# Altium project TeensyCrashDAQ.PrjPcb
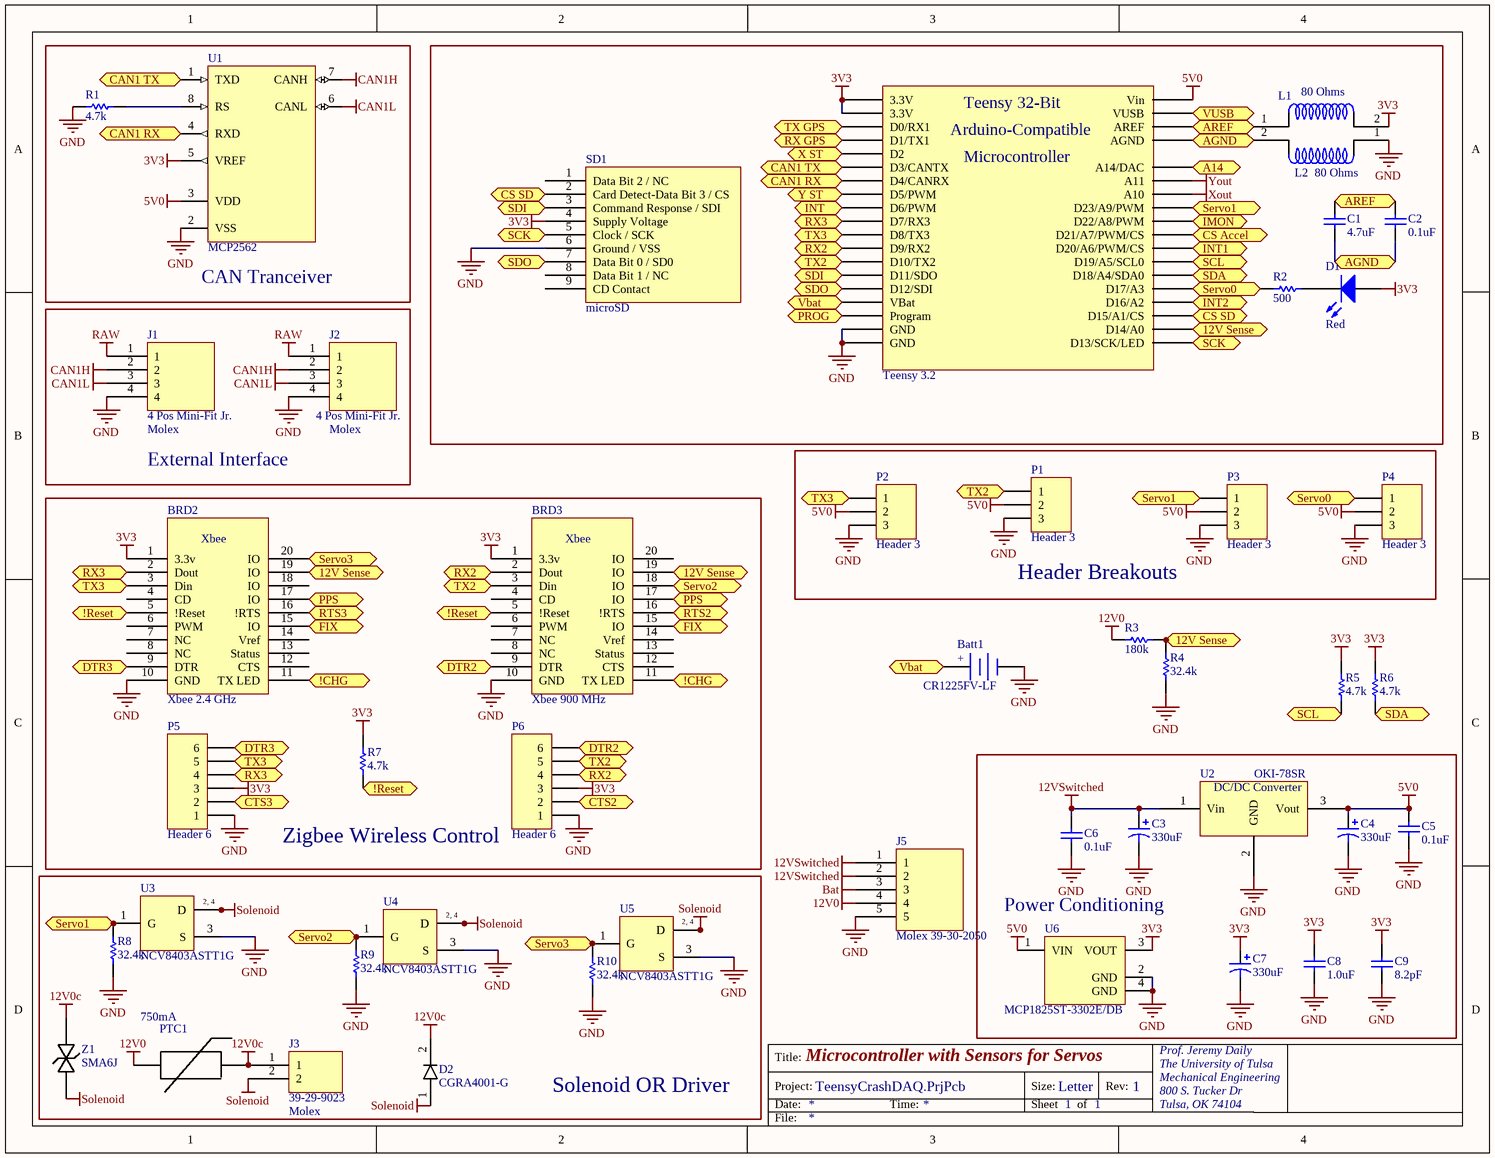
[diagram p0: TeensyCrashDAQ.SchDoc]
2 sheets, 103 parts. Net scope: flat (ports and power ports of the same name join across sheets).
Board file: CrashDAQ For Hammond 1554H.PcbDoc
Sheets:
  TeensyCrashDAQ.SchDoc
  CrashDAQSensors.SchDoc

## Sheet TeensyCrashDAQ.SchDoc: Microcontroller with Sensors for Servos
size Letter; Author: Prof. Jeremy Daily; Organization: The University of Tulsa; Address1: Mechanical Engineering; Address2: 800 S. Tucker Dr; Address3: Tulsa, OK 74104; DocumentNumber: 1; Revision: 1; SheetNumber: 1; SheetTotal: 1

### Parts
Batt1  CR1225FV-LF  [Coin Cell with Tabs]
BRD1  Teensy 3.2  [Teensy]
BRD2  Xbee 2.4 GHz  [Xbee]
BRD3  Xbee 900 MHz  [Xbee]
C1  4.7uF  [1206]
C2  0.1uF  [0603]
C3  330uF  [Elec. Cap 5 x 10mm]
C4  330uF  [Elec. Cap 5 x 10mm]
C5  0.1uF  [0603]
C6  0.1uF  [0603]
C7  330uF  [Elec. Cap 5 x 10mm]
C8  1.0uF  [0603]
C9  8.2pF  [0603]
D1  Red  [0805 Polarized]
D2  CGRA4001-G  [SMA with A and K]
J1  4 Pos Mini-Fit Jr.  Manufacturer: Molex  [4 POS Vertical MINI-FIT JR]
J2  4 Pos Mini-Fit Jr.  Manufacturer: Molex  [4 POS Vertical MINI-FIT JR]
J3  39-29-9023  Manufacturer: Molex  [2 POS Vertical MINI-FIT JR]
J5  Molex 39-30-2050  [5 POS Vert MINI-FIT JR]
L1  80 Ohms  [0805]
L2  80 Ohms  [0805]
P1  Header 3  [HDR1X3]
P2  Header 3  [HDR1X3]
P3  Header 3  [HDR1X3]
P4  Header 3  [HDR1X3]
P5  Header 6  [HDR1X6]
P6  Header 6  [HDR1X6]
PTC1  750mA  [2920]
R1  4.7k  [0603]
R2  500  [0603]
R3  180k  [0603]
R4  32.4k  [0603]
R5  4.7k  [0603]
R6  4.7k  [0603]
R7  4.7k  [0603]
R8  32.4k  [0603]
R9  32.4k  [0603]
R10  32.4k  [0603]
SD1  microSD  [SD Card Holder]
U1  MCP2562  [SOIC-8]
U2  OKI-78SR  [78xx]
U3  NCV8403ASTT1G  [ONSC-SOT-223-4-318E-04_V]
U4  NCV8403ASTT1G  [ONSC-SOT-223-4-318E-04_V]
U5  NCV8403ASTT1G  [ONSC-SOT-223-4-318E-04_V]
U6  MCP1825ST-3302E/DB  [SOT-223-DB3_M]
Z1  SMA6J  [SMA]

### Blocks framed on the sheet
CAN Tranceiver: R1 U1
External Interface: J1 J2
Header Breakouts: P1-P4
Zigbee Wireless Control: BRD2 BRD3 P5 P6 R7
Power Conditioning: C3-C9 U2 U6
Solenoid OR Driver: D2 J3 PTC1 R8-R10 U3-U5 Z1

### Ports
12V Sense, !CHG, !Reset, A14, AGND, AREF, CAN1 RX, CAN1 TX, CS Accel, CS SD, CTS2, CTS3, DTR2, DTR3, FIX, IMON, INT, INT1, INT2, PPS, PROG, RTS2, RTS3, RX2, RX3, RX GPS, SCK, SCL, SDA, SDI, SDO, Servo0, Servo1, Servo2, Servo3, TX2, TX3, TX GPS, Vbat, VUSB, X ST, Y ST

### Nets
3V3: BRD1.16(3.3V) BRD1.31(3.3V) BRD2.1(3.3v) BRD3.1(3.3v) C7.1 C8.2 C9.2 D1.1(A) L1.2 P5.3 P6.3 R5.2 R6.2 R7.2 SD1.4(Supply_Voltage) U1.5(VREF) U6.3(VOUT)
5V0: BRD1.33(Vin) C4.1 C5.2 P1.2 P2.2 P3.2 P4.2 U1.3(VDD) U2.3(Vout) U6.1(VIN)
12V0: J5.4 PTC1.1 R3.1
12V0c: D2.2(K) J3.1 PTC1.2 Z1.1(A)
12VSwitched: C3.1 C6.2 J5.1 J5.2 U2.1(Vin)
Bat: J5.3
CAN1H: J1.2 J2.2 U1.7(CANH)
CAN1L: J1.3 J2.3 U1.6(CANL)
GND: Batt1.2(-) BRD1.14(GND) BRD1.17(GND) BRD2.10(GND) BRD3.10(GND) C3.2 C4.2 C5.1 C6.1 C7.2 C8.1 C9.1 J1.4 J2.4 J5.5 L2.1 P1.3 P2.3 P3.3 P4.3 P5.1 P6.1 R1.1 R4.1 R8.1 R9.1 R10.1 SD1.6(Ground_/_VSS) U1.2(VSS) U2.2(GND) U3.3(S) U4.3(S) U5.3(S) U6.2(GND) U6.4(GND)
RAW: J1.1 J2.1
Solenoid: D2.1(A) J3.2 U3.2(D) U3.4(D) U4.2(D) U4.4(D) U5.2(D) U5.4(D) Z1.2(K)
Xout: BRD1.36(A10)
Yout: BRD1.37(A11)
NetBatt1_1: Batt1.1(+) BRD1.15(VBat) ; port Vbat
NetBRD1_1: BRD1.1(D12/SDI) SD1.7(Data_Bit_0_/_SD0) ; port SDO
NetBRD1_2: BRD1.2(D11/SDO) SD1.3(Command_Response_/_SDI) ; port SDI
NetBRD1_3: BRD1.3(D10/TX2) BRD3.3(Din) P1.1 P6.5 ; port TX2
NetBRD1_4: BRD1.4(D9/RX2) BRD3.2(Dout) P6.4 ; port RX2
NetBRD1_5: BRD1.5(D8/TX3) BRD2.3(Din) P2.1 P5.5 ; port TX3
NetBRD1_6: BRD1.6(D7/RX3) BRD2.2(Dout) P5.4 ; port RX3
NetBRD1_7: BRD1.7(D6/PWM) ; port INT
NetBRD1_8: BRD1.8(D5/PWM) ; port Y ST
NetBRD1_9: BRD1.9(D4/CANRX) U1.4(RXD) ; port CAN1 RX
NetBRD1_10: BRD1.10(D3/CANTX) U1.1(TXD) ; port CAN1 TX
NetBRD1_11: BRD1.11(D2) ; port X ST
NetBRD1_12: BRD1.12(D1/TX1) ; port RX GPS
NetBRD1_13: BRD1.13(D0/RX1) ; port TX GPS
NetBRD1_18: BRD1.18(Program) ; port PROG
NetBRD1_19: BRD1.19(A14/DAC) ; port A14
NetBRD1_20: BRD1.20(D13/SCK/LED) SD1.5(Clock_/_SCK) ; port SCK
NetBRD1_21: BRD1.21(D14/A0) BRD2.19(IO) BRD3.19(IO) R3.2 R4.2 ; port 12V Sense
NetBRD1_22: BRD1.22(D15/A1/CS) SD1.2(Card_Detect-Data_Bit_3_/_CS) ; port CS SD
NetBRD1_23: BRD1.23(D16/A2) ; port INT2
NetBRD1_24: BRD1.24(D17/A3) P4.1 R2.2 ; port Servo0
NetBRD1_25: BRD1.25(D18/A4/SDA0) R6.1 ; port SDA
NetBRD1_26: BRD1.26(D19/A5/SCL0) R5.1 ; port SCL
NetBRD1_27: BRD1.27(D20/A6/PWM/CS) ; port INT1
NetBRD1_28: BRD1.28(D21/A7/PWM/CS) ; port CS Accel
NetBRD1_29: BRD1.29(D22/A8/PWM) ; port IMON
NetBRD1_30: BRD1.30(D23/A9/PWM) P3.1 R8.2 U3.1(G) ; port Servo1
NetBRD1_32: BRD1.32(AGND) C1.1 C2.1 L2.2 ; port AGND
NetBRD1_34: BRD1.34(VUSB) ; port VUSB
NetBRD1_35: BRD1.35(AREF) C1.2 C2.2 L1.1 ; port AREF
NetBRD2_5: BRD2.5(!Reset) BRD3.5(!Reset) R7.1 ; port !Reset
NetBRD2_9: BRD2.9(DTR) P5.6 ; port DTR3
NetBRD2_11: BRD2.11(TX_LED) BRD3.11(TX_LED) ; port !CHG
NetBRD2_15: BRD2.15(IO) BRD3.15(IO) ; port FIX
NetBRD2_16: BRD2.16(!RTS) ; port RTS3
NetBRD2_17: BRD2.17(IO) BRD3.17(IO) ; port PPS
NetBRD2_20: BRD2.20(IO) R10.2 U5.1(G) ; port Servo3
NetBRD3_9: BRD3.9(DTR) P6.6 ; port DTR2
NetBRD3_16: BRD3.16(!RTS) ; port RTS2
NetBRD3_18: BRD3.18(IO) R9.2 U4.1(G) ; port Servo2
NetD1_2: D1.2(K) R2.1
NetP5_2: P5.2 ; port CTS3
NetP6_2: P6.2 ; port CTS2
NetR1_2: R1.2 U1.8(RS)

Not connected (* = marked no-connect by the designer): BRD2 4(CD) 6(PWM) 7(NC) 8(NC) 12(CTS) 13(Status) 14(Vref) 18(IO); BRD3 4(CD) 6(PWM) 7(NC) 8(NC) 12(CTS) 13(Status) 14(Vref) 20(IO); SD1 1(Data_Bit_2_/_NC) 8(Data_Bit_1_/_NC) 9(CD_Contact)

### Notes on the sheet
- Title:
- Project:
- Date:
- Time:
- Sheet
- Size:
- Letter
- of
- Rev:
- File:
- (in symbol 7805) DC/DC Converter
- (in symbol NCV8403ASTT1G) 2, 4
- (in symbol Teensy) Teensy 32-Bit; Arduino-Compatible; Microcontroller

### Library data of the parts
Batt1 = CR2032 Battery Holder: Coin Cell Battery 3V 2-PIN VERT 48mAh 12.5 x 2.5mm; Manufacturer: Renata; Supplier 1: Mouser; Supplier Part Number 1: 614-CR1225FV-LF; PartNumber: CR1225FV-LF
BRD1 = Teensy: 32 Bit Arduino-Compatible Microcontroller; Manufacturer: PRJC; PartNumber: Teensy 3.2; Supplier 1: Sparkfun; Supplier Part Number 1: DEV-13736
BRD2 BRD3 = Xbee
C1 = Cap: 4.7µF ±10% 50V X7R Ceramic Capacitor -55°C ~ 125°C Surface Mount, MLCC 1206; Manufacturer: Samsung Electro-Mechanics America, Inc.; PartNumber: CL31B475KBHNNNE; Supplier 1: Digi-Key; Supplier Part Number 1: 1276-2789-1-ND
C2 C5 C6 = Cap: 0.10µF ±10% 50V X7R Ceramic Capacitor -55°C ~ 125°C Surface Mount, MLCC 0603 (1608 Metric) 0.063" L x 0.031" W (1.60mm x 0.80mm); Manufacturer: Murata Electronics North America; PartNumber: GRM188R71H104KA93D; Supplier 1: Digi-Key; Supplier Part Number 1: 490-1519-1-ND
C3 C4 C7 = SMD Elec: CAP ALUM 330UF 20% 50V RADIAL; Manufacturer: Panasonic Electronic Components; PartNumber: ECA-1HM331; Supplier 1: Digi-Key; Supplier Part Number 1: P5184-ND
C8 = Cap: 1µF ±10% 10V X5R Ceramic Capacitor -55°C ~ 85°C Surface Mount, MLCC 0603 (1608 Metric) 0.063" L x 0.031" W (1.60mm x 0.80mm); Manufacturer: Murata Electronics North America; PartNumber: GRM188R61A105KA61D; Supplier 1: Digi-Key; Supplier Part Number 1: 490-1543-1-ND
C9 = Cap: 8.2pF ±0.5pF 50V C0G, NP0 Ceramic Capacitor -55°C ~ 125°C Surface Mount, MLCC 0201 (0603 Metric) 0.024" L x 0.012" W (0.60mm x 0.30mm); Manufacturer: Murata Electronics North America; PartNumber: GRM0335C1H8R2DA01D; Supplier 1: Digi-Key; Supplier Part Number 1: 490-6133-2-ND
D1 = LED - SMD: LED RED DIFFUSED 0805 SMD; Manufacturer: OSRAM Opto Semiconductors Inc.; PartNumber: LS R976-NR-1; Supplier 1: Digi-Key; Supplier Part Number 1: 475-1278-1-ND
D2 = Diode: DIODE GEN PURP 50V 1A DO214AC; Supplier 1: Digi-Key
J1 J2 = 4 Pos Header Vert: CONN HEADER 4POS 4.2MM VERT TIN; Supplier 1: Mouser; Supplier 2: Mouser; PartNumber: 39-29-9040; Supplier Part Number 1: 538-39-29-9040; Supplier Part Number 2: 538-39-29-9040
J3 = 2 Pos Header Vert: 2 Positions Header, Shrouded Connector Through Hole Tin; PartNumber: 39-29-9023; Supplier 1: Digi-Key; Supplier 2: Mouser; Supplier Part Number 1: WM3853-ND; Supplier Part Number 2: 538-39-29-9023
J5 = 5 Pos Header Vert: Molex Mint Fit Jr 5 CKT VERT HEADER
L1 L2 = Ferrite Bead: Ferrite Bead 80ohms 100MHz 5A Monolithic 0805 SMD; Manufacturer: Laird Technologies; PartNumber: HI0805R800R-10; Supplier 1: Mouser; Supplier Part Number 1: 875-HI0805R800R-10
P1-P4 = Header 3: Header, 3-Pin; LatestRevisionDate: 17-Jul-2002; LatestRevisionNote: Re-released for DXP Platform.; Publisher: Altium Limited
P5 P6 = Header 6: Header, 6-Pin; LatestRevisionDate: 17-Jul-2002; LatestRevisionNote: Re-released for DXP Platform.; Publisher: Altium Limited
PTC1 = PTC: PTC RESETBL 60V 750MA SMD 2920; Manufacturer: Littelfuse; PartNumber: 2920L075/60MR; Supplier 1: Digi-Key; Supplier Part Number 1: F5633CT-ND
R1 R5-R7 = Chip Resistor: 4.7k Ohm ±1% 0.1W, 1/10W Surface Mount Resistor Thick Film ±100ppm/°C 0603; Manufacturer: Panasonic Electronic Components; PartNumber: ERJ-3EKF4701V; Supplier 1: Digi-Key; Supplier Part Number 1: P4.70KHCT-ND
R2 R3 = Chip Resistor: Manufacturer: Panasonic Electronic Components; PartNumber: ERJ-3EKF1001V; Supplier 1: Digi-Key; Supplier Part Number 1: P1.00KHCT-ND
R4 R8-R10 = Chip Resistor: 32.4k Ohm ±1% 0.1W, 1/10W Surface Mount Resistor Thick Film ±100ppm/°C 0603; Manufacturer: Panasonic Electronic Components; PartNumber: ERJ-3EKF3242V; Supplier 1: Digi-Key; Supplier Part Number 1: P32.4KHCT-ND
SD1 = SD Card Holder: CONN MICRO SD CARD PUSH-PUSH R/A; Manufacturer: Amphenol Commercial Products; PartNumber: 101-00660-68-6; Supplier 1: Digi-Key; Supplier Part Number 1: 101-00660-68-6-1-ND
U1 = MCP2551-I/P: High-Speed CAN Transceiver, 8-Pin PDIP, Industrial Temperature; Manufacturer: Microchip; PartNumber: MCP2562FD-E/P; DatasheetVersion: revF, Jul-2010; PackageVersion: revBB, Aug-2009; PackageReference: PDIP300-P8; PackageDescription: 8-Lead Plastic Dual In-Line (P) - 300 mil Body [PDIP]; Supplier 1: Mouser; Supplier Part Number 1: 579-MCP2562FD-E/P; Supplier 2: Farnell; Supplier Part Number 2: 1292240; Supplier 3: Newark; Supplier Part Number 3: 61K2947; Supplier 4: Mouser; Supplier Part Number 4: 579-MCP2551-I/P; Mounting Technology: Through Hole; Code_JEDEC: MS-001; ComponentLink1Description: Manufacturer URL; ComponentLink1URL: http://www.microchip.com/; ComponentLink2Description: Datasheet; ComponentLink2URL: http://ww1.microchip.com/downloads/en/DeviceDoc/21667F.pdf; ComponentLink3Description: Package Specification; ComponentLink3URL: http://www.microchip.com/stellent/groups/techpub_sg/documents/packagingspec/en012702.pdf
U2 = 7805: 5V DC/DC Converter (7805 replacement); Manufacturer: Murata Power Solutions; PartNumber: OKI-78SR-5/1.5-W36H-C; Supplier 1: Mouser; Supplier 2: Digi-Key; Supplier Part Number 1: 580-OKI78SR51.5W36HC; Supplier Part Number 2: 811-2692-ND
U3-U5 = NCV8403ASTT1G: Self-Protected Low Side Driver with Temperature and Current Limit, 4-Pin SOT-223, Pb-Free, Tape and Reel; Manufacturer: On Semiconductor; Channel Polarity: N Channel; DatasheetVersion: Rev. 5; PackageVersion: Rev. N, 08/2009; PackageReference: SOT-223-4-318E-04; PackageDescription: 4-Pin Small Outline Transistor, Body 6.5 x 3.5 mm, Pitch 2.3 mm; Supplier 1: Digi-Key; Supplier Part Number 1: NCV8403ASTT1G-ND; Supplier 2: Mouser; Supplier Part Number 2: 863-NCV8403ASTT1G; Packing: Tape and Reel; RoHS: Pb-Free; Mounting Technology: Surface Mount; PartNumber: NCV8403ASTT1G; ComponentLink1Description: Manufacturer URL; ComponentLink1URL: http://www.onsemi.com/; ComponentLink2Description: Datasheet; ComponentLink2URL: http://www.onsemi.com/pub_link/Collateral/NCV8403-D.PDF; ComponentLink3Description: Package Specification; ComponentLink3URL: http://www.onsemi.com/pub_link/Collateral/318E-04.PDF
U6 = MCP1825ST-3302E/DB: 500 mA, Low Voltage, Low Quiescent Current LDO Regulator, 3-Pin SOT-223, Extended Temperature, Tape and Reel; Manufacturer: Microchip; DatasheetVersion: revB, Feb-2008; PackageVersion: revBB, Aug-2009; PackageReference: SOT-223-DB3; PackageDescription: 3-Lead Plastic Small Outline Transistor (DB) [SOT-223]; Supplier 1: Digi-Key; Supplier Part Number 1: MCP1825ST-3302E/DBTR-ND; Supplier 2: Mouser; Supplier Part Number 2: 579-MCP1825ST3302EDB; Mounting Technology: Surface Mount; PartNumber: MCP1825ST-3302E/DB; ComponentLink1Description: Manufacturer URL; ComponentLink1URL: http://www.microchip.com/; ComponentLink2Description: Datasheet; ComponentLink2URL: http://ww1.microchip.com/downloads/en/DeviceDoc/22056b.pdf; ComponentLink3Description: Package Specification; ComponentLink3URL: http://www.microchip.com/stellent/groups/techpub_sg/documents/packagingspec/en012702.pdf
Z1 = Zener - Bidirectional: TVS DIODE 15VWM 24.4VC SMA; Manufacturer: STMicroelectronics; PartNumber: P6KE18CA; Supplier 1: Mouser; Supplier Part Number 1: 511-P6KE18CA

## Sheet CrashDAQSensors.SchDoc
size Letter
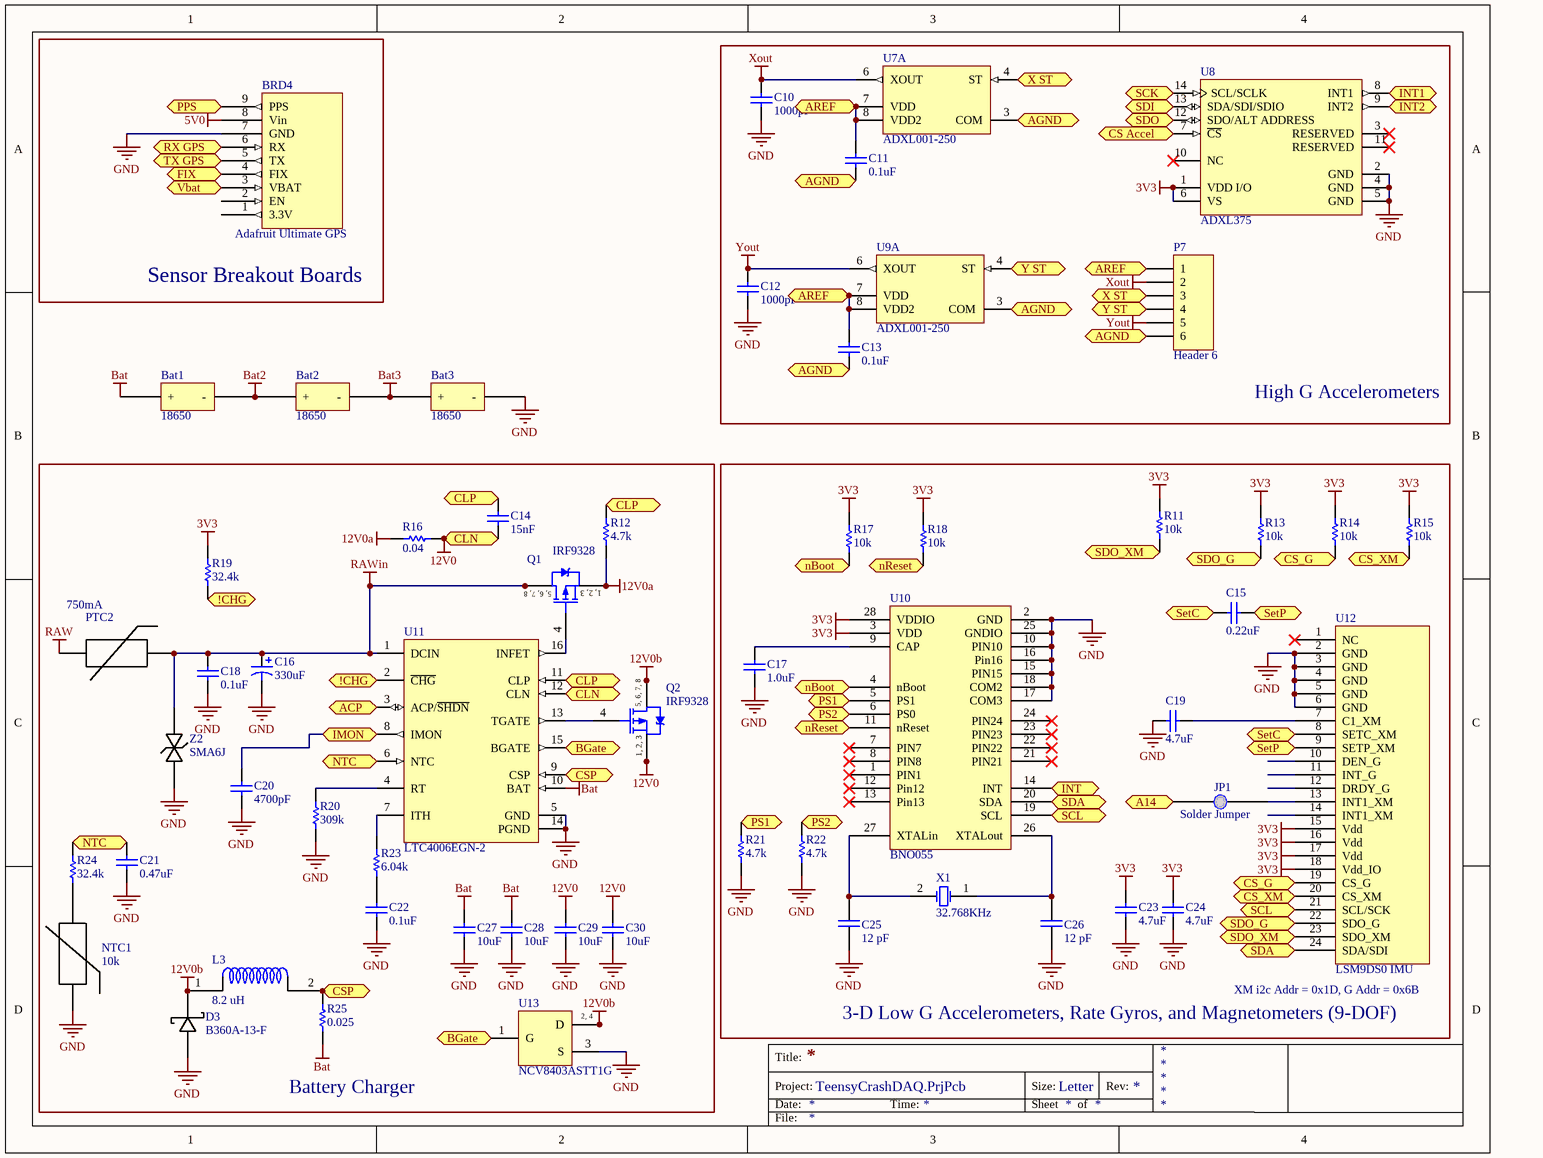
[diagram p1: CrashDAQSensors.SchDoc]

### Parts
Bat1  18650  [18650 Holder]
Bat2  18650  [18650 Holder]
Bat3  18650  [18650 Holder]
BRD4  Adafruit Ultimate GPS  [GPS]
C10  1000pF  [0603]
C11  0.1uF  [0603]
C12  1000pF  [0603]
C13  0.1uF  [0603]
C14  15nF  [0603]
C15  0.22uF  [0603]
C16  330uF  [Elec. Cap 5 x 10mm]
C17  1.0uF  [0603]
C18  0.1uF  [0603]
C19  4.7uF  [1206]
C20  4700pF  [0603]
C21  0.47uF  [0603]
C22  0.1uF  [0603]
C23  4.7uF  [1206]
C24  4.7uF  [1206]
C25  12 pF  [0603]
C26  12 pF  [0603]
C27  10uF  [1206]
C28  10uF  [1206]
C29  10uF  [1206]
C30  10uF  [1206]
D3  B360A-13-F  [SMA with A and K]
JP1  Solder Jumper  [Solder Jumper]
L3  8.2 uH  [Inductor - 1045]
NTC1  10k  [0603]
P7  Header 6  [HDR1X6]
PTC2  750mA  [2920]
Q1  IRF9328  [SOIC-8]
Q2  IRF9328  [SOIC-8]
R11  10k  [0603]
R12  4.7k  [0603]
R13  10k  [0603]
R14  10k  [0603]
R15  10k  [0603]
R16  0.04  [2818]
R17  10k  [0603]
R18  10k  [0603]
R19  32.4k  [0603]
R20  309k  [0603]
R21  4.7k  [0603]
R22  4.7k  [0603]
R23  6.04k  [0603]
R24  32.4k  [0603]
R25  0.025  [2818]
U7  ADXL001-250  [ADI-E-8-1_V]  (part A of 2)
U8  ADXL375  [ADI-CC-14-1_V]
U9  ADXL001-250  [ADI-E-8-1_V]  (part A of 2)
U10  BNO055  [BNO055 LGA]
U11  LTC4006EGN-2  [LT-GN-16_N]
U12  LSM9DS0 IMU  [LGA 4x4x1 mm 24-lead]
U13  NCV8403ASTT1G  [ONSC-SOT-223-4-318E-04_V]
X1  32.768KHz  [XTAL 2 pad]
Z2  SMA6J  [SMA]

### Blocks framed on the sheet
Sensor Breakout Boards: BRD4
High G Accelerometers: C10-C13 P7 U7-U9
Battery Charger: C14 C16 C18 C20-C22 C27-C30 D3 L3 NTC1 PTC2 Q1 Q2 R12 R16 R19 R20 R23-R25 U11 U13 Z2
XM i2c Addr = 0x1D, G Addr = 0x6B: C15 C17 C19 C23-C26 JP1 R11 R13-R15 R17 R18 R21 R22 U10 U12 X1

### Ports
!CHG, A14, ACP, AGND, AREF, BGate, CLN, CLP, CS Accel, CS_G, CS_XM, CSP, FIX, IMON, INT, INT1, INT2, nBoot, nReset, NTC, PPS, PS1, PS2, RX GPS, SCK, SCL, SDA, SDI, SDO, SDO_G, SDO_XM, SetC, SetP, TX GPS, Vbat, X ST, Y ST

### Nets
3V3: C23.2 C24.2 R11.2 R13.2 R14.2 R15.2 R17.2 R18.2 R19.2 U8.1(VDD_I/O) U8.6(VS) U10.3(VDD) U10.28(VDDIO) U12.15(Vdd) U12.16(Vdd) U12.17(Vdd) U12.18(Vdd_IO)
5V0: BRD4.8(Vin)
12V0: C14.1 C29.2 C30.2 Q2.1(S) Q2.2(S) Q2.3(S) R16.2 U11.12(CLN) ; port CLN
12V0a: Q1.1(S) Q1.2(S) Q1.3(S) R12.2 R16.1
12V0b: D3.2(K) L3.1 Q2.5(D) Q2.6(D) Q2.7(D) Q2.8(D) U13.2(D) U13.4(D)
Bat: Bat1.1(+) C27.2 C28.2 R25.2 U11.10(BAT)
Bat2: Bat1.2(-) Bat2.1(+)
Bat3: Bat2.2(-) Bat3.1(+)
GND: Bat3.2(-) BRD4.7(GND) C10.1 C12.1 C16.2 C17.1 C18.1 C19.2 C20.1 C21.1 C22.1 C23.1 C24.1 C25.1 C26.1 C27.1 C28.1 C29.1 C30.1 D3.1(A) NTC1.1 R20.2 R21.1 R22.1 U8.2(GND) U8.4(GND) U8.5(GND) U10.2(GND) U10.10(PIN10) U10.15(PIN15) U10.16(Pin16) U10.17(COM3) U10.18(COM2) U10.25(GNDIO) U11.5(GND) U11.14(PGND) U12.2(GND) U12.3(GND) U12.4(GND) U12.5(GND) U12.6(GND) U13.3(S) Z2.2(K)
RAW: PTC2.1
RAWin: C16.1 C18.2 PTC2.2 Q1.5(D) Q1.6(D) Q1.7(D) Q1.8(D) U11.1(DCIN) Z2.1(A)
Xout: C10.2 P7.2 U7.6(XOUT)
Yout: C12.2 P7.5 U9.6(XOUT)
NetBatt1_1: BRD4.3(VBAT) ; port Vbat
NetBRD1_1: U8.12(SDO/ALT_ADDRESS) ; port SDO
NetBRD1_2: U8.13(SDA/SDI/SDIO) ; port SDI
NetBRD1_7: U10.14(INT) ; port INT
NetBRD1_8: P7.4 U9.4(ST) ; port Y ST
NetBRD1_11: P7.3 U7.4(ST) ; port X ST
NetBRD1_12: BRD4.6(RX) ; port RX GPS
NetBRD1_13: BRD4.5(TX) ; port TX GPS
NetBRD1_19: JP1.1 ; port A14
NetBRD1_20: U8.14(SCL/SCLK) ; port SCK
NetBRD1_23: U8.9(INT2) ; port INT2
NetBRD1_25: U10.20(SDA) U12.24(SDA/SDI) ; port SDA
NetBRD1_26: U10.19(SCL) U12.21(SCL/SCK) ; port SCL
NetBRD1_27: U8.8(INT1) ; port INT1
NetBRD1_28: U8.7(~{CS}) ; port CS Accel
NetBRD1_29: C20.2 U11.8(IMON) ; port IMON
NetBRD1_32: C11.1 C13.1 P7.6 U7.3(COM) U9.3(COM) ; port AGND
NetBRD1_35: C11.2 C13.2 P7.1 U7.7(VDD) U7.8(VDD2) U9.7(VDD) U9.8(VDD2) ; port AREF
NetBRD2_11: R19.1 U11.2(~{CHG}) ; port !CHG
NetBRD2_15: BRD4.4(FIX) ; port FIX
NetBRD2_17: BRD4.9(PPS) ; port PPS
NetC14_2: C14.2 R12.1 U11.11(CLP) ; port CLP
NetC15_1: C15.1 U12.9(SETP_XM) ; port SetP
NetC15_2: C15.2 U12.8(SETC_XM) ; port SetC
NetC17_2: C17.2 U10.9(CAP)
NetC19_1: C19.1 U12.7(C1_XM)
NetC21_2: C21.2 R24.1 U11.6(NTC) ; port NTC
NetC22_2: C22.2 R23.2
NetC25_2: C25.2 U10.27(XTALin) X1.2(OSC2)
NetC26_2: C26.2 U10.26(XTALout) X1.1(OSC1)
NetJP1_2: JP1.2 U12.13(INT1_XM)
NetL3_2: L3.2 R25.1 U11.9(CSP) ; port CSP
NetNTC1_2: NTC1.2 R24.2
NetQ1_4: Q1.4(G) U11.16(INFET)
NetQ2_4: Q2.4(G) U11.13(TGATE)
NetR11_1: R11.1 U12.23(SDO_XM) ; port SDO_XM
NetR13_1: R13.1 U12.22(SDO_G) ; port SDO_G
NetR14_1: R14.1 U12.19(CS_G) ; port CS_G
NetR15_1: R15.1 U12.20(CS_XM) ; port CS_XM
NetR17_1: R17.1 U10.4(nBoot) ; port nBoot
NetR18_1: R18.1 U10.11(nReset) ; port nReset
NetR20_1: R20.1 U11.4(RT)
NetR21_2: R21.2 U10.5(PS1) ; port PS1
NetR22_2: R22.2 U10.6(PS0) ; port PS2
NetR23_1: R23.1 U11.7(ITH)
NetU11_3: U11.3(ACP/~{SHDN}) ; port ACP
NetU11_15: U11.15(BGATE) U13.1(G) ; port BGate

Not connected (* = marked no-connect by the designer): BRD4 1(3.3V) 2(EN); U8 3(RESERVED)* 10(NC)* 11(RESERVED)*; U10 1(PIN1)* 7(PIN7)* 8(PIN8)* 12(Pin12)* 13(Pin13)* 21(PIN21)* 22(PIN22)* 23(PIN23)* 24(PIN24)*; U12 1(NC)* 10(DEN_G) 11(INT_G) 12(DRDY_G) 14(INT1_XM)

### Notes on the sheet
- 3-D Low G Accelerometers, Rate Gyros, and Magnetometers (9-DOF)
- Title:
- Project:
- Date:
- Time:
- Sheet
- Size:
- Letter
- of
- Rev:
- File:
- (in symbol IRF9328 P-FET) 5, 6, 7, 8; 1, 2, 3
- (in symbol NCV8403ASTT1G) 2, 4

### Library data of the parts
Bat1-Bat3 = Battery: MPD one 18650 LI-ION Cell Holder BK-1850-PC2
BRD4 = GPS - Adafruit
C10 C12 = Cap: 1000pF ±10% 50V X7R Ceramic Capacitor -55°C ~ 125°C Surface Mount, MLCC 0603 (1608 Metric) 0.063" L x 0.031" W (1.60mm x 0.80mm); Manufacturer: Murata Electronics North America; PartNumber: GRM188R71H102KA01D; Supplier 1: Digi-Key; Supplier Part Number 1: 490-1494-1-ND
C11 C13 C18 C22 = Cap: as C2 on sheet TeensyCrashDAQ; Supplier 1: Digi-Key; Supplier Part Number 1: 490-1519-1-ND
C14 = Cap: CAP CER 0.015UF 50V X7R 0603; Manufacturer: Samsung Electro-Mechanics America, Inc.; PartNumber: CL10B153KB8SFNC; Supplier 1: Digi-Key; Supplier Part Number 1: 1276-1967-1-ND
C15 = Cap: 0.22µF ±10% 25V X7R Ceramic Capacitor -55°C ~ 125°C Surface Mount, MLCC 0603 (1608 Metric) 0.063" L x 0.031" W (1.60mm x 0.80mm); Manufacturer: Murata Electronics North America; PartNumber: GRM188R71E224KA88D; Supplier 1: Digi-Key; Supplier Part Number 1: 490-3290-1-ND
C16 = SMD Elec: as C3 on sheet TeensyCrashDAQ; Supplier 1: Digi-Key; Supplier Part Number 1: P5184-ND
C17 = Cap: as C8 on sheet TeensyCrashDAQ; Supplier 1: Digi-Key; Supplier Part Number 1: 490-1543-1-ND
C19 C23 C24 = Cap: as C1 on sheet TeensyCrashDAQ; Supplier 1: Digi-Key; Supplier Part Number 1: 1276-2789-1-ND
C20 = Cap: Manufacturer: Murata Electronics North America; PartNumber: GRM188R71H472KA01D; Supplier 1: Digi-Key; Supplier Part Number 1: 490-1506-1-ND
C21 = Cap: 0.47µF ±10% 25V X7R Ceramic Capacitor -55°C ~ 125°C Surface Mount, MLCC 0603 (1608 Metric) 0.063" L x 0.031" W (1.60mm x 0.80mm); Manufacturer: Murata Electronics North America; PartNumber: GRM188R71E474KA12D; Supplier 1: Digi-Key; Supplier Part Number 1: 490-3291-1-ND
C25 C26 = Cap: CAP CER 12PF 50V NP0 0603; Manufacturer: Murata Electronics North America; PartNumber: GRM1885C1H120JA01D; Supplier 1: Digi-Key; Supplier Part Number 1: 490-1405-1-ND; Supplier 2: Mouser; Supplier Part Number 2: 81-GRM39C120J50
C27-C30 = Cap: 10µF -20%, +80% 16V Y5V (F) Ceramic Capacitor -30°C ~ 85°C Surface Mount, MLCC 120; Manufacturer: Yageo; PartNumber: CC1206ZKY5V7BB106; Supplier 1: Digi-Key; Supplier Part Number 1: 311-1376-1-ND
D3 = Schottky Diode: DIODE SCHOTTKY 60V 3A SMA; Manufacturer: Diodes Incorporated; Supplier 1: Digi-Key; Supplier Part Number 1: B360A-FDICT-ND; PartNumber: B360A-13-F
L3 = Inductor: FIXED IND 8.2UH 5.05A 28.6 MOHM; Manufacturer: Wurth Electronics Inc; PartNumber: 7447797820; Supplier 1: Digi-Key; Supplier Part Number 1: 732-2213-1-ND
NTC1 = NTC: THERMISTOR 10K OHM NTC 0603 SMD; Manufacturer: Murata Electronics North America; PartNumber: NCP18XH103F03RB; Supplier 1: Digi-Key; Supplier Part Number 1: 490-4800-1-ND
P7 = Header 6: Header, 6-Pin; LatestRevisionDate: 17-Jul-2002; LatestRevisionNote: Re-released for DXP Platform.; Publisher: Altium Limited
PTC2 = PTC: as PTC1 on sheet TeensyCrashDAQ; Supplier 1: Digi-Key; Supplier Part Number 1: F5633CT-ND
Q1 Q2 = IRF9328 P-FET: MOSFET P-CH 30V 12A 8-SOIC; Supplier 1: Digi-Key
R11 R13-R15 R17 R18 = Chip Resistor: 10k Ohm ±1% 0.1W, 1/10W Surface Mount Resistor Thick Film ±100ppm/°C 0603; Manufacturer: Panasonic Electronic Components; PartNumber: ERJ-3EKF1002V; Supplier 1: Digi-Key; Supplier Part Number 1: P10.0KHCT-ND
R12 R21 R22 = Chip Resistor: as R1 on sheet TeensyCrashDAQ; Supplier 1: Digi-Key; Supplier Part Number 1: P4.70KHCT-ND
R16 = Chip Resistor: 0.04 Ohm ±1% 7W Surface Mount Resistor Metal Element ±75ppm/°C 2818; Manufacturer: Vishay Dale; PartNumber: WSHM2818R0400FEA; Supplier 1: Digi-Key; Supplier Part Number 1: 541-2632-1-ND
R19 R24 = Chip Resistor: as R4 on sheet TeensyCrashDAQ; Supplier 1: Digi-Key; Supplier Part Number 1: P32.4KHCT-ND
R20 = Chip Resistor: Manufacturer: Panasonic Electronic Components; PartNumber: ERJ-6ENF4701V; Supplier 1: Digi-Key; Supplier Part Number 1: P4.70KCCT-ND
R23 = Chip Resistor: 6.04k Ohm ±1% 0.1W, 1/10W Surface Mount Resistor Thick Film ±100ppm/°C 0603; Manufacturer: Stackpole Electronics Inc.; PartNumber: RMCF0603FT6K04; Supplier 1: Digi-Key; Supplier Part Number 1: RMCF0603FT6K04CT-ND
R25 = Chip Resistor: 0.025 Ohm ±1% 7W Surface Mount Resistor Metal Element ±75ppm/°C 2818; Manufacturer: Vishay Dale; PartNumber: WSHM2818R0250FEA; Supplier 1: Digi-Key; Supplier Part Number 1: 541-2629-1-ND
U7 U9 = AD22279-A: Single-Axis, High-g, iMEMS(R) Accelerometers with Analog Output, 400 Hz BW, Industrial, 8-pin LCC, Reel; Manufacturer: Analog Devices; # of Axes: 1; -3dB Bandwidth: 400 Hz; Automotive Qualified: Yes; Sensitivity: 55 mV/g; Supply Current: 1.3 mA; Voltage Supply (V): 4.75 to 5.25; DatasheetVersion: Rev. B; PackageVersion: 05-21-2010-D, 05/2010; PackageReference: E-8-1; PackageDescription: 8-Pin Ceramic Leadless Chip Carrier, 5 x 5 mm Body, 1.27 mm Pitch; Supplier 1: Digi-Key; Supplier Part Number 1: AD22279-A-ND; Supplier 2: Mouser; Supplier Part Number 2: 584-AD22279-A; Output Type: Analog; Packing: Reel; Mounting Technology: Surface Mount; PartNumber: AD22279-A; ComponentLink1Description: Manufacturer URL; ComponentLink1URL: http://www.analog.com/en/index.html; ComponentLink2Description: Datasheet; ComponentLink2URL: http://www.analog.com/static/imported-files/data_sheets/ADXL78.pdf; ComponentLink3Description: Package Specification; ComponentLink3URL: http:/www.analog.com/static/imported-files/packages/PKG_PDF/LCC(E)/E_8_1.pdf; ComponentLink4Description: Product URL; ComponentLink4URL: http://www.analog.com/en/mems-sensors/mems-inertial-sensors/adxl78/products/product.html
U8 = ADXL343BCCZ: 3-Axis, +/-2 g / +/-4 g / +/-8 g / +/-16 g Digital MEMS Accelerometer with Digital Output, 1.6 KHz BW, Industrial, 14-pin LGA, Tray; Manufacturer: Analog Devices; # of Axes: 3; -3dB Bandwidth: 1.6 KHz; Sensitivity: 256/128/64/32 LSB/g; Voltage Supply (V): 2.0 to 3.6; DatasheetVersion: Rev. 0; PackageVersion: 03-16-2010-A, 03/2010; PackageReference: CC-14-1; PackageDescription: 14-Pin Land Grid Array, 3 x 5 mm Body, 0.8 mm Pitch; Supplier 1: Digi-Key; Supplier Part Number 1: ADXL343BCCZ-ND; Supplier 2: Farnell; Supplier Part Number 2: 2191716; Supplier 3: Newark; Supplier Part Number 3: 90T1358; Supplier 4: Newark; Supplier Part Number 4: 43W5524; Supplier 5: Mouser; Supplier Part Number 5: 584-ADXL343BCCZ; Output Type: Digital; Packing: Tray; Mounting Technology: Surface Mount; PartNumber: ADXL343BCCZ; ComponentLink1Description: Manufacturer URL; ComponentLink1URL: http://www.analog.com/en/index.html; ComponentLink2Description: Datasheet; ComponentLink2URL: http://www.analog.com/static/imported-files/data_sheets/ADXL343.pdf; ComponentLink3Description: Package Specification; ComponentLink3URL: http://www.analog.com/static/imported-files/data_sheets/ADXL343.pdf; ComponentLink4Description: Product URL; ComponentLink4URL: http://www.analog.com/en/mems-sensors/mems-inertial-sensors/adxl343/products/product.html
U10 = BNO055: IMUs - Inertial Measurement Units Absolute Orientation 9-Axis Sensor; Manufacturer: Bosch Sensortec; PartNumber: BNO055; Supplier 1: Mouser; Supplier Part Number 1: 262-BNO055
U11 = LTC4006EGN-2: 4 A, High Efficiency, Standalone Li-Ion Battery Charger, 6 to 28 V Vin, 16-pin SOP (GN-16), -40 to 85 degC; Manufacturer: Linear Technology; Battery Chemistry: Li-Ion, Li-Polymer; Charge Termination: On-board timer; Float Voltage: 12.6 V; Number of Cells: 2 to 4; Type of Charger: Switching; Vin Max(V): 28; Vin Min(V): 6; DatasheetVersion: Rev. A; PackageVersion: Rev. B, 03/2012; PackageReference: GN-16; PackageDescription: 16-Pin Plastic SSOP, Body 4.9 x 3.9 mm, Pitch 0.635 mm; Supplier 1: Digi-Key; Supplier Part Number 1: LTC4006EGN-2-ND; RoHS: FALSE; Mounting Technology: Surface Mount; PartNumber: LTC4006EGN-2; ComponentLink1Description: Manufacturer URL; ComponentLink1URL: http://www.linear.com/; ComponentLink2Description: Datasheet; ComponentLink2URL: http://cds.linear.com/docs/en/datasheet/4006fa.pdf; ComponentLink3Description: Package Specification; ComponentLink3URL: http://cds.linear.com/docs/en/packaging/05081641_B_GN16.pdf
U13 = NCV8403ASTT1G: as U3 on sheet TeensyCrashDAQ; DatasheetVersion: Rev. 5; PackageVersion: Rev. N, 08/2009; PackageReference: SOT-223-4-318E-04; PackageDescription: 4-Pin Small Outline Transistor, Body 6.5 x 3.5 mm, Pitch 2.3 mm; Supplier 1: Digi-Key; Supplier Part Number 1: NCV8403ASTT1G-ND; Supplier 2: Mouser; Supplier Part Number 2: 863-NCV8403ASTT1G; Packing: Tape and Reel; RoHS: Pb-Free; Mounting Technology: Surface Mount; PartNumber: NCV8403ASTT1G; ComponentLink1Description: Manufacturer URL; ComponentLink1URL: http://www.onsemi.com/; ComponentLink2Description: Datasheet; ComponentLink2URL: http://www.onsemi.com/pub_link/Collateral/NCV8403-D.PDF; ComponentLink3Description: Package Specification; ComponentLink3URL: http://www.onsemi.com/pub_link/Collateral/318E-04.PDF
X1 = Crystal Oscillator: Crystal 32.7680kHz 20ppm 12.5pF 70 kOhm -40°C - 85°C Surface Mount 2-SMD; Manufacturer: ECS Inc.; PartNumber: ECS-.327-12.5-39-TR; Supplier 1: Digi-Key; Supplier Part Number 1: XC1658CT-ND; Supplier 2: Mouser; Supplier Part Number 2: 520-.327-12.5-39-TR
Z2 = Zener - Bidirectional: as Z1 on sheet TeensyCrashDAQ; Supplier 1: Mouser; Supplier Part Number 1: 511-P6KE18CA
JP1 = Solder Jumper: Supplier 1: Digi-Key

## Nets that join several sheets
3V3: TeensyCrashDAQ (17 pins), CrashDAQSensors (17 pins)
5V0: TeensyCrashDAQ (10 pins), CrashDAQSensors (BRD4.8)
12V0: TeensyCrashDAQ (J5.4 PTC1.1 R3.1), CrashDAQSensors (8 pins)
Bat: TeensyCrashDAQ (J5.3), CrashDAQSensors (5 pins)
GND: TeensyCrashDAQ (35 pins), CrashDAQSensors (43 pins)
RAW: TeensyCrashDAQ (J1.1 J2.1), CrashDAQSensors (PTC2.1)
Xout: TeensyCrashDAQ (BRD1.36), CrashDAQSensors (C10.2 P7.2 U7.6)
Yout: TeensyCrashDAQ (BRD1.37), CrashDAQSensors (C12.2 P7.5 U9.6)
NetBatt1_1: TeensyCrashDAQ (Batt1.1 BRD1.15), CrashDAQSensors (BRD4.3)
NetBRD1_1: TeensyCrashDAQ (BRD1.1 SD1.7), CrashDAQSensors (U8.12)
NetBRD1_2: TeensyCrashDAQ (BRD1.2 SD1.3), CrashDAQSensors (U8.13)
NetBRD1_7: TeensyCrashDAQ (BRD1.7), CrashDAQSensors (U10.14)
NetBRD1_8: TeensyCrashDAQ (BRD1.8), CrashDAQSensors (P7.4 U9.4)
NetBRD1_11: TeensyCrashDAQ (BRD1.11), CrashDAQSensors (P7.3 U7.4)
NetBRD1_12: TeensyCrashDAQ (BRD1.12), CrashDAQSensors (BRD4.6)
NetBRD1_13: TeensyCrashDAQ (BRD1.13), CrashDAQSensors (BRD4.5)
NetBRD1_19: TeensyCrashDAQ (BRD1.19), CrashDAQSensors (JP1.1)
NetBRD1_20: TeensyCrashDAQ (BRD1.20 SD1.5), CrashDAQSensors (U8.14)
NetBRD1_23: TeensyCrashDAQ (BRD1.23), CrashDAQSensors (U8.9)
NetBRD1_25: TeensyCrashDAQ (BRD1.25 R6.1), CrashDAQSensors (U10.20 U12.24)
NetBRD1_26: TeensyCrashDAQ (BRD1.26 R5.1), CrashDAQSensors (U10.19 U12.21)
NetBRD1_27: TeensyCrashDAQ (BRD1.27), CrashDAQSensors (U8.8)
NetBRD1_28: TeensyCrashDAQ (BRD1.28), CrashDAQSensors (U8.7)
NetBRD1_29: TeensyCrashDAQ (BRD1.29), CrashDAQSensors (C20.2 U11.8)
NetBRD1_32: TeensyCrashDAQ (BRD1.32 C1.1 C2.1 L2.2), CrashDAQSensors (5 pins)
NetBRD1_35: TeensyCrashDAQ (BRD1.35 C1.2 C2.2 L1.1), CrashDAQSensors (7 pins)
NetBRD2_11: TeensyCrashDAQ (BRD2.11 BRD3.11), CrashDAQSensors (R19.1 U11.2)
NetBRD2_15: TeensyCrashDAQ (BRD2.15 BRD3.15), CrashDAQSensors (BRD4.4)
NetBRD2_17: TeensyCrashDAQ (BRD2.17 BRD3.17), CrashDAQSensors (BRD4.9)